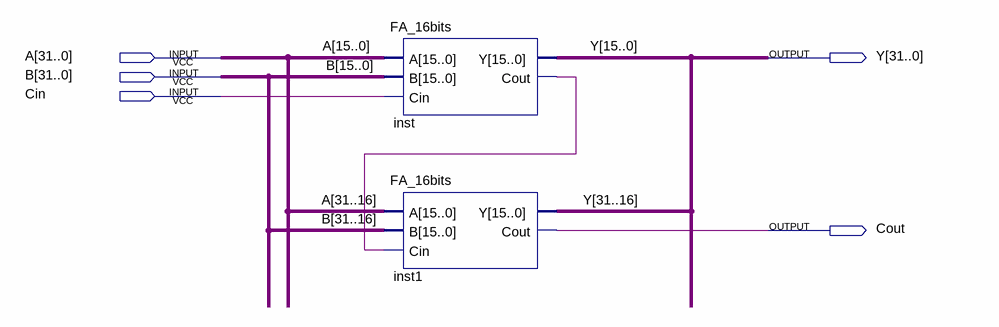
[diagram p0: schematic sheet]
// Quartus schematic FA_32bits.bdf as structural Verilog: 2 symbols, 5 pins
module FA_32bits (
  input  [31:0] A,
  input  [31:0] B,
  input  Cin,
  output [31:0] Y,
  output Cout
);

  wire inst_cout;

  FA_16bits inst (.A(A[15:0]), .B(B[15:0]), .Cin(Cin), .Y(Y[15:0]), .Cout(inst_cout));
  FA_16bits inst1 (.A(A[31:16]), .B(B[31:16]), .Cin(inst_cout), .Y(Y[31:16]), .Cout(Cout));
endmodule
